# Altium schematic sheet Ematches.SchDoc
size A
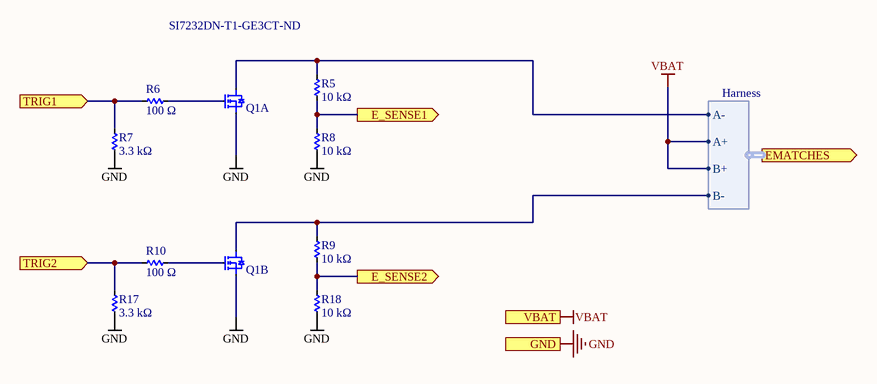
[diagram p0: Ematches.SchDoc]

## Parts
Q1  Supplier Part Number 1: SI7232DN-T1-GE3CT-ND  [POWERPAK_1212-8_DUAL]  (hidden comment: NFET_SI7232DN)  (parts A,B of 2)
R5  Resistance: 10 kΩ  [R0603]  (hidden comment: __template_resistor)
R6  Resistance: 100 Ω  [R0603]  (hidden comment: __template_resistor)
R7  Resistance: 3.3 kΩ  [R0603]  (hidden comment: __template_resistor)
R8  Resistance: 10 kΩ  [R0603]  (hidden comment: __template_resistor)
R9  Resistance: 10 kΩ  [R0603]  (hidden comment: __template_resistor)
R10  Resistance: 100 Ω  [R0603]  (hidden comment: __template_resistor)
R17  Resistance: 3.3 kΩ  [R0603]  (hidden comment: __template_resistor)
R18  Resistance: 10 kΩ  [R0603]  (hidden comment: __template_resistor)

## Ports
E_SENSE1 (out), E_SENSE2 (out), EMATCHES (out, harness Harness), GND (in), TRIG1 (in), TRIG2 (in), VBAT (in)

## Harnesses
Harness: A-, A+, B+, B-

## Nets
GND: Q1.1 Q1.3 R7.1 R8.2 R17.1 R18.2 ; port GND
VBAT: port VBAT, port EMATCHES.A+, port EMATCHES.B+
E_SENSE1: R5.2 R8.1 ; port E_SENSE1
E_SENSE2: R9.2 R18.1 ; port E_SENSE2
TRIG1: R6.1 R7.2 ; port TRIG1
TRIG2: R10.1 R17.2 ; port TRIG2
NetQ1_2: Q1.2 R6.2
NetQ1_4: Q1.4 R10.2
NetQ1_5: Q1.5 R9.1 ; port EMATCHES.B-
NetQ1_7: Q1.7 R5.1 ; port EMATCHES.A-

## Library data of the parts
Q1 = NFET_SI7232DN: MOSFET 2N-CH 20V 25A PPAK 1212-8; Manufacturer: Vishay Siliconix; Manufacturer Part Number: SI7232DN-T1-GE3; FET Type: 2 N-Channel (Dual); FET Feature: Logic Level Gate; Rds On (Max) @ Id, Vgs: 16.4 mOhm @ 10A, 4.5V; Vgs(th) (Max) @ Id: 1V @ 250µA; Gate Charge (Qg) @ Vgs: 32nC @ 8V; Input Capacitance (Ciss) @ Vds: 1220pF @ 10V; Power - Max: 23W; Supplier 1: Digi-Key; RoHS: RoHS Compliant; Category: Discrete Semiconductor Products; Stock 1: 12645; Pricing 1: 1=0.89, 10=0.782, 25=0.7344, 100=0.5994, 250=0.55672, 500=0.4738, 1000=0.37904 (USD); Packaging: Cut Tape (CT); Drain to Source Voltage (Vdss): 20V; Current - Continuous Drain (Id) @ 25°C: 25A; Operating Temperature: -55°C ~ 150°C (TJ); Mounting Type: Surface Mount; Package / Case: PowerPAK® 1212-8 Dual; Supplier Device Package: PowerPAK® 1212-8 Dual; ComponentLink1URL: http://www.vishay.com/docs/68986/si7232dn.pdf; ComponentLink1Description: http://www.vishay.com/docs/68986/si7232dn.pdf
R5 R8 R9 R18 = 311-10.0KHRCT-ND: RES SMD 10K OHM 1% 1/10W 0603; Manufacturer Part Number: RC0603FR-0710KL; Manufacturer: Yageo; Power (Watts): 0.1W, 1/10W; Resistance (Sortable): 10000; Temperature Coefficient: ±100ppm/°C; Tolerance: ±1%; Supplier Part Number 1: 311-10.0KHRCT-ND; Supplier 1: Digikey; Datasheets: http://www.yageo.com/documents/recent/PYu-RC_Group_51_RoHS_L_9.pdf; Image: //media.digikey.com/Renders/Yageo%20Renders/0603-(1608-Metric).jpg; Operating Temperature: -55°C ~ 155°C
R6 R10 = 311-100HRCT-ND: RES SMD 100 OHM 1% 1/10W 0603; Manufacturer Part Number: RC0603FR-07100RL; Manufacturer: Yageo; Power (Watts): 0.1W, 1/10W; Resistance (Sortable): 100; Temperature Coefficient: ±100ppm/°C; Tolerance: ±1%; Supplier Part Number 1: 311-100HRCT-ND; Supplier 1: Digikey; Datasheets: http://www.yageo.com/documents/recent/PYu-RC_Group_51_RoHS_L_9.pdf; Image: //media.digikey.com/Renders/Yageo%20Renders/0603-(1608-Metric).jpg; Operating Temperature: -55°C ~ 155°C
R7 R17 = 311-3.30KHRCT-ND: RES SMD 3.3K OHM 1% 1/10W 0603; Manufacturer Part Number: RC0603FR-073K3L; Manufacturer: Yageo; Power (Watts): 0.1W, 1/10W; Resistance (Sortable): 3300; Temperature Coefficient: ±100ppm/°C; Tolerance: ±1%; Supplier Part Number 1: 311-3.30KHRCT-ND; Supplier 1: Digikey; Datasheets: http://www.yageo.com/documents/recent/PYu-RC_Group_51_RoHS_L_9.pdf; Image: //media.digikey.com/Renders/Yageo%20Renders/0603-(1608-Metric).jpg; Operating Temperature: -55°C ~ 155°C